# EAGLE design rj45-2x10 (EAGLE 6.5.0)
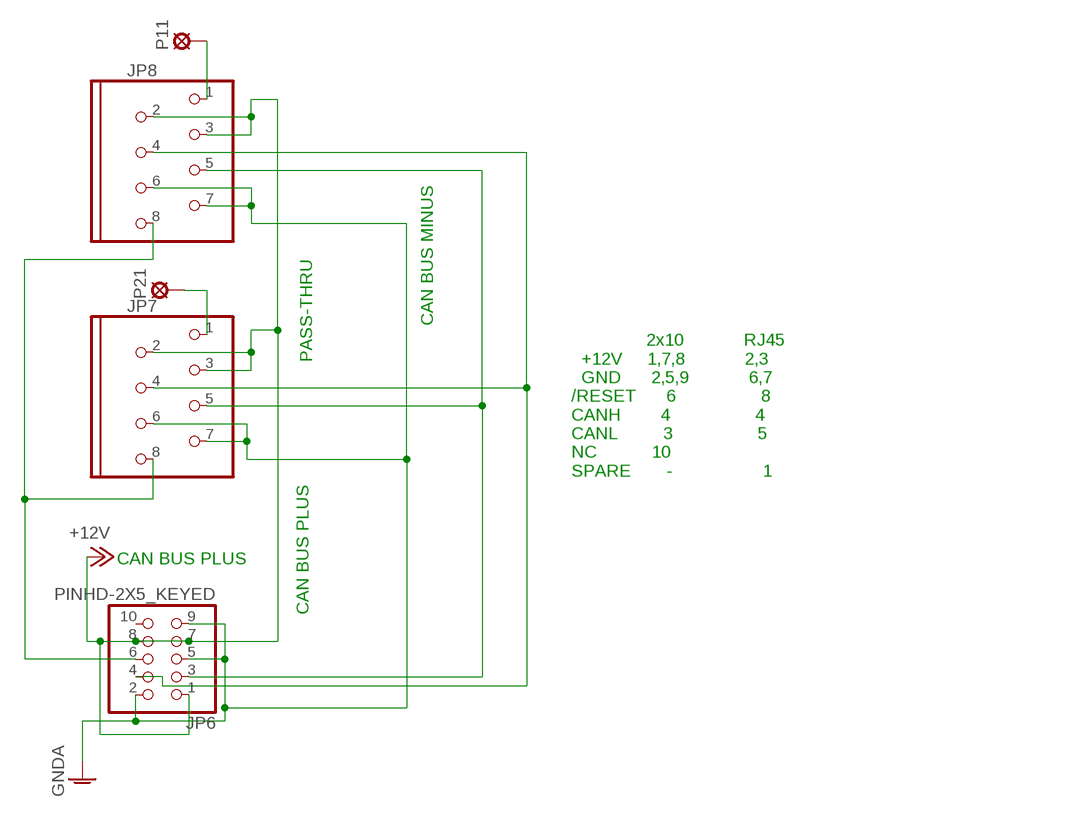
[diagram p0: schematic, sheet 1]

## Parts
JP6  PINHD-2X5_KEYED  [2X05_KEYED]
JP7  MOD8P8C  [MOD8P8C]
JP8  MOD8P8C  [MOD8P8C]
P11  SOLPAD035  [SOLDPAD035]
P21  SOLPAD035  [SOLDPAD035]

## Nets
+12V: JP6.1 JP6.7 JP6.8 JP7.2 JP7.3 JP8.2 JP8.3
CANCABLE_1_1: JP8.1 P11.MP
CANCABLE_2_1: JP7.1 P21.MP
CANH: JP6.4 JP7.4 JP8.4
CANL: JP6.3 JP7.5 JP8.5
GNDA: JP6.2 JP6.5 JP6.9 JP7.6 JP7.7 JP8.6 JP8.7
MASTER-RESET-SYS: JP6.6 JP7.8 JP8.8
Unconnected: JP6.10

## Notes on the sheet
- PASS-THRU
- CAN BUS MINUS
- 2x10            RJ45
    +12V     1,7,8            2,3
    GND      2,5,9            6,7
  /RESET      6                 8
  CANH        4                 4
  CANL         3                 5
  NC           10                                  
  SPARE       -                  1
- CAN BUS PLUS
- CAN BUS PLUS

## Library data of the parts
JP6 = pinhead:PINHD-2X5_KEYED
JP7 JP8 = DEH:MOD8P8C
P11 P21 = solpad:SOLPAD035

## Board
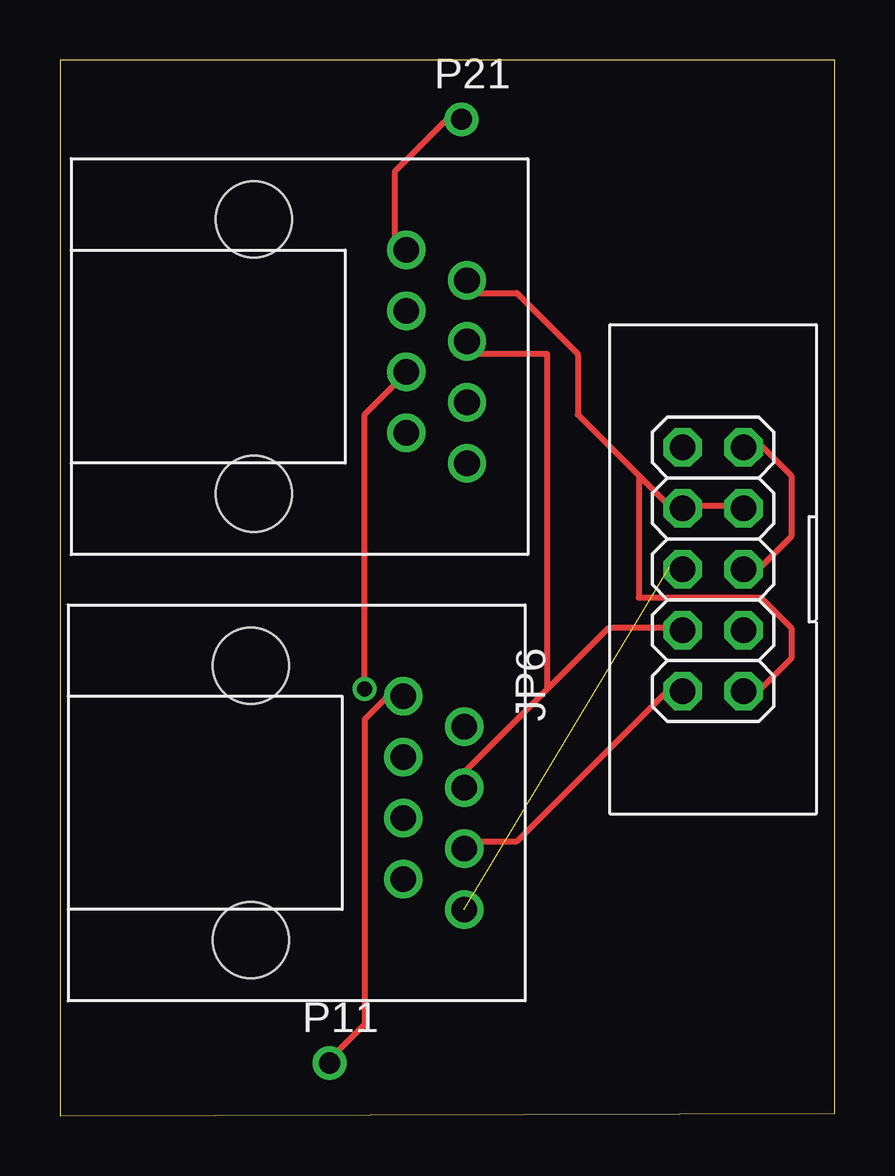
[diagram p1: board, top side]
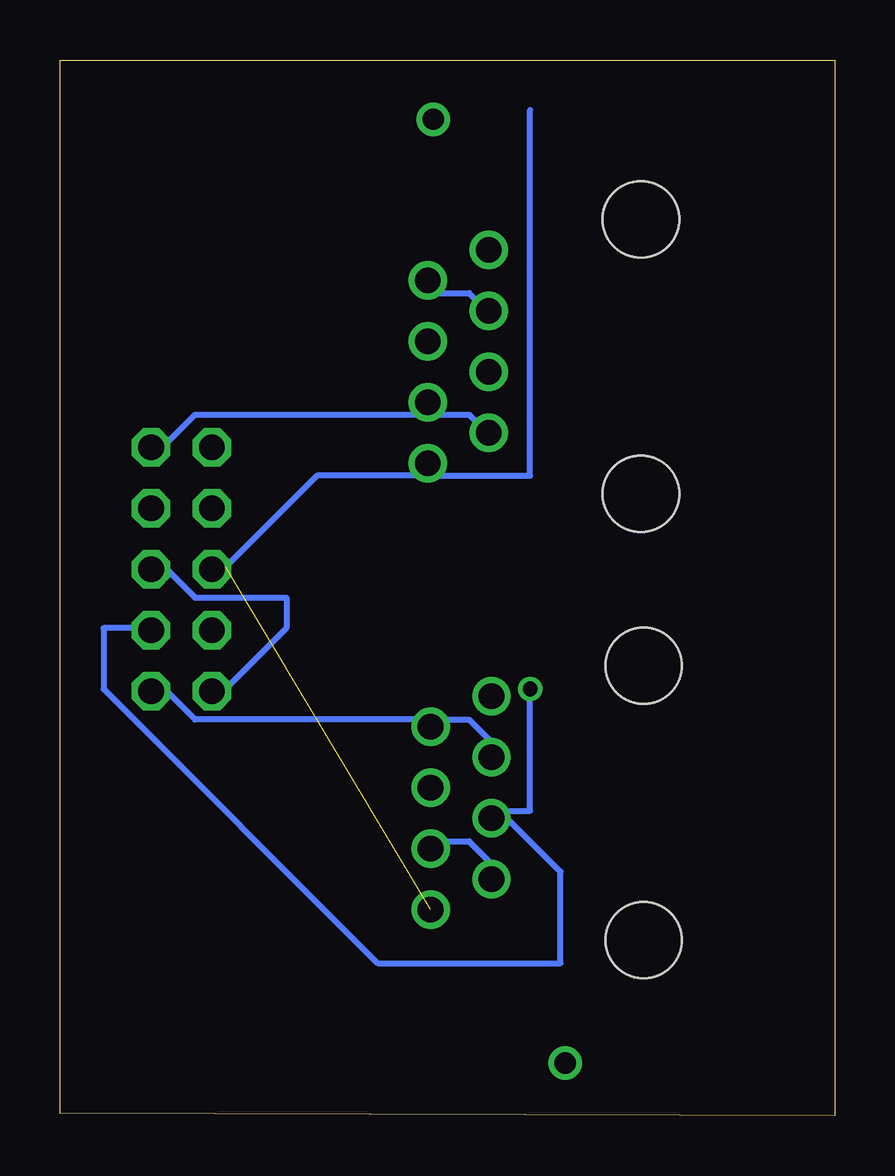
[diagram p2: board, bottom side, seen from below]

Size 32.3 x 44 mm. Coordinates in mm from the lower left corner, seen from the top.
Outline: 0,0 32.3,0.1 32.3,44 0,44 0,0
Copper layers (1*16): Top 0.035mm / dielectric 1.5mm / Bottom 0.035mm
Design rules "default": minimum track width 10mil, minimum drill 24mil, track to track 8mil, track to pad 8mil, pad to pad 8mil, via to via 8mil, smd to smd 8mil, copper to edge 40mil, drill to drill 8mil, minimum pad ring 10mil, minimum via ring 8mil, stop-mask expansion 4mil, vias tented up to drill 0mil, thermal gap 10mil

### Footprints (pad centres in the part's own frame; a part is rotated, then mirrored left to right if it is on the bottom)
2X05_KEYED = drill 1.067 octagon: 1 -5.08,-1.27; 2 -5.08,1.27; 3 -2.54,-1.27; 4 -2.54,1.27; 5 0,-1.27; 6 0,1.27; 7 2.54,-1.27; 8 2.54,1.27; 9 5.08,-1.27; 10 5.08,1.27
MOD8P8C = drill 1.067 pad 1.397: 1 -3.81,-2.54; 2 -2.54,0; 3 -1.27,-2.54; 4 0,0; 5 1.27,-2.54; 6 2.54,0; 7 3.81,-2.54; 8 5.08,0 | hole 3.175: -5.08,-8.89; 6.35,-8.89
SOLDPAD035 = drill 0.889 pad 1.27: MP 0,0

### Placement (x,y rotation side)
JP6  27.23,22.77 90 top
JP7  16.97,32.27 270 top
JP8  16.85,13.67 270 top
P11  11.24,2.19 0 top
P21  16.74,41.53 0 top

### Tracks (layer width: path | path; a pad name or v marks a point on that pad's centre or on a via)
+12V
  Top 0.254: JP6.7 27.94,25.4 26.67,25.4 JP6.8 25.4,25.4 24.13,26.67 | 24.13,26.67 21.59,29.21 21.59,31.75 19.05,34.29 16.51,34.29 JP7.2 | 24.13,26.67 24.13,21.59 29.21,21.59 30.48,20.32 30.48,19.05 29.21,17.78 JP6.1
  Bottom 0.254: 16.51,16.51 15.24,16.51 13.97,15.24 JP8.3 | 16.51,16.51 26.67,16.51 27.94,17.78 JP6.1 | 16.51,16.51 JP8.2 | JP7.3 13.97,33.02 15.24,34.29 16.51,34.29 JP7.2
CANCABLE_1_1
  Top 0.254: P11.MP 11.43,2.54 12.7,3.81 12.7,16.51 13.97,17.78 JP8.1
CANCABLE_2_1
  Top 0.254: P21.MP 16.51,41.91 13.97,39.37 13.97,35.56 JP7.1
CANH
  Top 0.254: 20.32,17.78 22.86,20.32 25.4,20.32 JP6.4 | 20.32,17.78 16.51,13.97 JP8.4 | 20.32,17.78 20.32,31.75 16.51,31.75 JP7.4
CANL  (via drill 0.61)
  Top 0.254: v12.7,17.78 12.7,29.21 13.97,30.48 JP7.5
  Bottom 0.254: 13.97,12.7 11.43,10.16 11.43,6.35 19.05,6.35 30.48,17.78 30.48,20.32 29.21,20.32 JP6.3 | v12.7,17.78 12.7,12.7 13.97,12.7 | 13.97,12.7 JP8.5
GNDA
  Top 0.254: JP6.2 25.4,17.78 19.05,11.43 16.51,11.43 JP8.6 | JP6.5 29.21,22.86 30.48,24.13 30.48,26.67 29.21,27.94 JP6.9
  Bottom 0.254: JP8.7 13.97,10.16 15.24,11.43 16.51,11.43 JP8.6 | 16.51,29.21 15.24,29.21 13.97,27.94 JP7.7 | 16.51,29.21 26.67,29.21 27.94,27.94 JP6.9 | 16.51,29.21 JP7.6 | JP6.2 25.4,17.78 22.86,20.32 22.86,21.59 26.67,21.59 27.94,22.86 JP6.5
MASTER-RESET-SYS  (1 unrouted)
  Bottom 0.254: 12.7,41.91 12.7,26.67 16.51,26.67 | 16.51,26.67 21.59,26.67 25.4,22.86 JP6.6 | 16.51,26.67 JP7.8